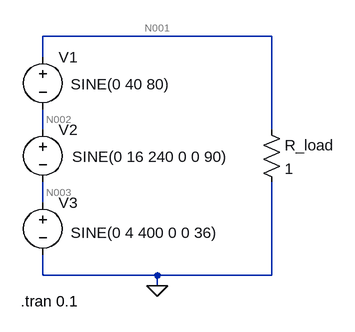
[diagram p0: schematic Three-harmonic-signal.asc]
Three-harmonic-signal.asc, the LTspice schematic file:
Version 4
SHEET 1 880 680
WIRE 384 0 32 0
WIRE 32 32 32 0
WIRE 32 144 32 112
WIRE 384 144 384 0
WIRE 32 256 32 224
WIRE 32 368 32 336
WIRE 208 368 32 368
WIRE 384 368 384 224
WIRE 384 368 208 368
WIRE 208 384 208 368
FLAG 208 384 0
SYMBOL voltage 32 16 R0
WINDOW 3 43 58 Left 2
WINDOW 123 0 0 Left 0
WINDOW 39 0 0 Left 0
SYMATTR InstName V1
SYMATTR Value SINE(0 40 80)
SYMBOL voltage 32 128 R0
WINDOW 3 45 57 Left 2
WINDOW 123 0 0 Left 0
WINDOW 39 0 0 Left 0
SYMATTR InstName V2
SYMATTR Value SINE(0 16 240 0 0 90)
SYMBOL voltage 32 240 R0
WINDOW 3 43 62 Left 2
WINDOW 123 0 0 Left 0
WINDOW 39 0 0 Left 0
SYMATTR InstName V3
SYMATTR Value SINE(0 4 400 0 0 36)
SYMBOL res 368 128 R0
SYMATTR InstName R_load
SYMATTR Value 1
TEXT -2 408 Left 2 !.tran 0.1

The netlist it stands for:
* Three-harmonic-signal.asc
V1 N001 N002 SINE(0 40 80)
V2 N002 N003 SINE(0 16 240 0 0 90)
V3 N003 0 SINE(0 4 400 0 0 36)
R_load N001 0 1
.tran 0.1
.backanno
.end

* Results of the author's LTspice run, read from the files saved beside the schematic
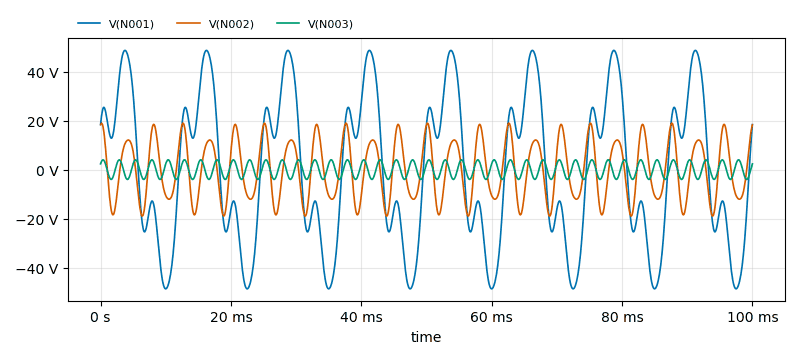
[diagram p1: Transient Analysis of Three-harmonic-signal.asc, plotted from the saved traces]
* Transient Analysis, 1 run:
*   V(N001): min -48.61 V, max 48.64 V, average -192.7 µV, rms 30.59 V, last 18.35 V
*   V(N002): min -18.97 V, max 18.97 V, average -188.4 µV, rms 11.66 V, last 18.35 V
*   V(N003): min -3.998 V, max 4 V, average -77.65 µV, rms 2.832 V, last 2.351 V